# Altium schematic sheet MSP430.SchDoc
size A
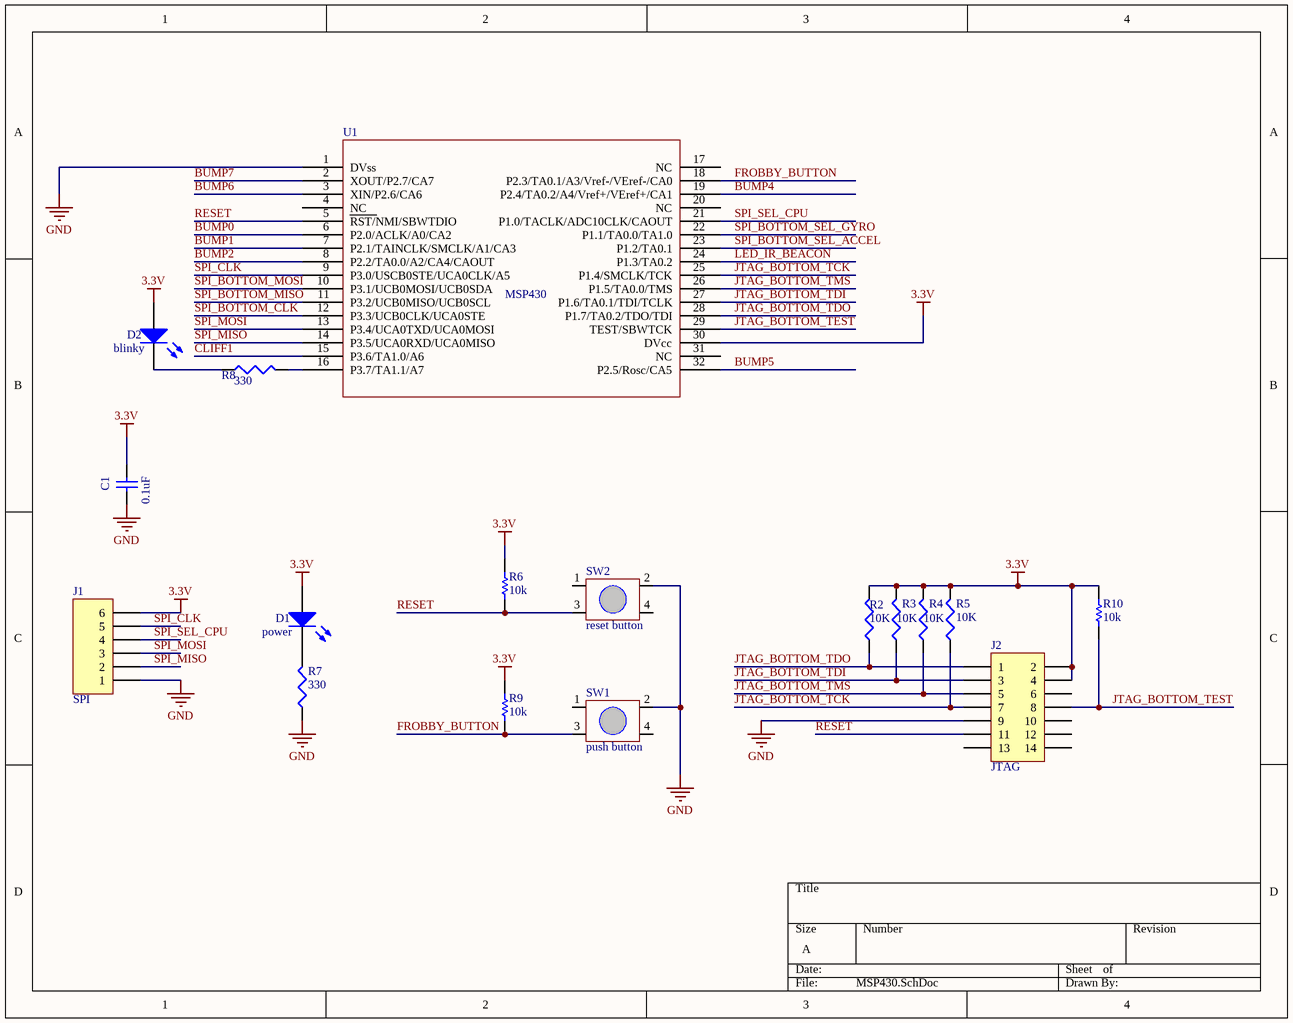
[diagram p0: MSP430.SchDoc]

## Parts
C1  value 0.1uF  [CAPC1005L]  (hidden comment: Cap Semi)
D1  power  [INDC2012L]
D2  blinky  [INDC2012L]
J1  SPI  [HDR1X6]
J2  JTAG  [HDR2X7]
R2  value 10K  [RESC1608L]  (hidden comment: Res3)
R3  value 10K  [RESC1608L]  (hidden comment: Res3)
R4  value 10K  [RESC1608L]  (hidden comment: Res3)
R5  value 10K  [RESC1608L]  (hidden comment: Res3)
R6  value 10k  [RESC1608L]  (hidden comment: Res Semi)
R7  330  [RESC1608L]
R8  330  [RESC1608L]
R9  value 10k  [RESC1608L]  (hidden comment: Res Semi)
R10  value 10k  [RESC1608L]  (hidden comment: Res Semi)
SW1  push button  [SwitchTall-TL330]
SW2  reset button  [SwitchTall-TL330]
U1  MSP430  [MSP430_32PIN]

## Nets
3.3V: C1.2 D1.1(A) D2.1(A) J1.6 J2.2 J2.4 R2.2 R3.2 R4.2 R5.2 R6.2 R9.2 R10.2 U1.30(DVcc)
GND: C1.1 J1.1 J2.9 R7.1 SW1.2 SW2.2 U1.1(DVss)
BUMP0: U1.6(P2.0/ACLK/A0/CA2)
BUMP1: U1.7(P2.1/TAINCLK/SMCLK/A1/CA3)
BUMP2: U1.8(P2.2/TA0.0/A2/CA4/CAOUT)
BUMP4: U1.19(P2.4/TA0.2/A4/Vref+/VEref+/CA1)
BUMP5: U1.32(P2.5/Rosc/CA5)
BUMP6: U1.3(XIN/P2.6/CA6)
BUMP7: U1.2(XOUT/P2.7/CA7)
CLIFF1: U1.15(P3.6/TA1.0/A6)
FROBBY_BUTTON: R9.1 SW1.3 U1.18(P2.3/TA0.1/A3/Vref-/VEref-/CA0)
JTAG_BOTTOM_TCK: J2.7 R5.1 U1.25(P1.4/SMCLK/TCK)
JTAG_BOTTOM_TDI: J2.3 R3.1 U1.27(P1.6/TA0.1/TDI/TCLK)
JTAG_BOTTOM_TDO: J2.1 R2.1 U1.28(P1.7/TA0.2/TDO/TDI)
JTAG_BOTTOM_TEST: J2.8 R10.1 U1.29(TEST/SBWTCK)
JTAG_BOTTOM_TMS: J2.5 R4.1 U1.26(P1.5/TA0.0/TMS)
LED_IR_BEACON: U1.24(P1.3/TA0.2)
RESET: J2.11 R6.1 SW2.3 U1.5(RST/NMI/SBWTDIO)
SPI_BOTTOM_CLK: U1.12(P3.3/UCB0CLK/UCA0STE)
SPI_BOTTOM_MISO: U1.11(P3.2/UCB0MISO/UCB0SCL)
SPI_BOTTOM_MOSI: U1.10(P3.1/UCB0MOSI/UCB0SDA)
SPI_BOTTOM_SEL_ACCEL: U1.23(P1.2/TA0.1)
SPI_BOTTOM_SEL_GYRO: U1.22(P1.1/TA0.0/TA1.0)
SPI_CLK: J1.5 U1.9(P3.0/USCB0STE/UCA0CLK/A5)
SPI_MISO: J1.2 U1.14(P3.5/UCA0RXD/UCA0MISO)
SPI_MOSI: J1.3 U1.13(P3.4/UCA0TXD/UCA0MOSI)
SPI_SEL_CPU: J1.4 U1.21(P1.0/TACLK/ADC10CLK/CAOUT)
NetD1_2: D1.2(K) R7.2
NetD2_2: D2.2(K) R8.1
NetR8_2: R8.2 U1.16(P3.7/TA1.1/A7)

Not connected (* = marked no-connect by the designer): J2 6 10 12 13 14; SW1 1 4; SW2 1 4; U1 4(NC) 17(NC) 20(NC) 31(NC)

## Library data of the parts
C1 = Cap Semi: Capacitor (Semiconductor SIM Model); Published: 8-Jun-2000; LatestRevisionDate: 29-May-2009; LatestRevisionNote: IPC-7351 Footprint Added.; PackageReference: C1206; Publisher: Altium Limited; PackageDescription: Chip Capacitor
D1 D2 = LED
J1 = Header 6: Header, 6-Pin; LatestRevisionDate: 17-Jul-2002; LatestRevisionNote: Re-released for DXP Platform.; Publisher: Altium Limited
J2 = Header 7X2: Header, 7-Pin, Dual row; LatestRevisionDate: 17-Jul-2002; LatestRevisionNote: Re-released for DXP Platform.; Publisher: Altium Limited
R2-R5 = Res3: Resistor; Published: 8-Jun-2000; LatestRevisionDate: 29-May-2009; LatestRevisionNote: IPC-7351 Footprint Added.; PackageReference: J1-0603; Publisher: Altium Limited; PackageDescription: Chip Resistor
R6 R9 R10 = Res Semi: Semiconductor Resistor; Published: 8-Jun-2000; LatestRevisionDate: 17-Jul-2002; LatestRevisionNote: Re-released for DXP Platform.; PackageReference: AXIAL-0.5; Publisher: Altium Limited
R7 = Res3: Resistor; Value: res3; Published: 8-Jun-2000; LatestRevisionDate: 29-May-2009; LatestRevisionNote: IPC-7351 Footprint Added.; PackageReference: J1-0603; Publisher: Altium Limited; PackageDescription: Chip Resistor
R8 = Res3: Resistor; Value: RES3; Published: 8-Jun-2000; LatestRevisionDate: 29-May-2009; LatestRevisionNote: IPC-7351 Footprint Added.; PackageReference: J1-0603; Publisher: Altium Limited; PackageDescription: Chip Resistor
SW1 SW2 = Switch-TL330
U1 = MSP430_32pin